# Altium project FREQUENCY_METER.PrjPcb
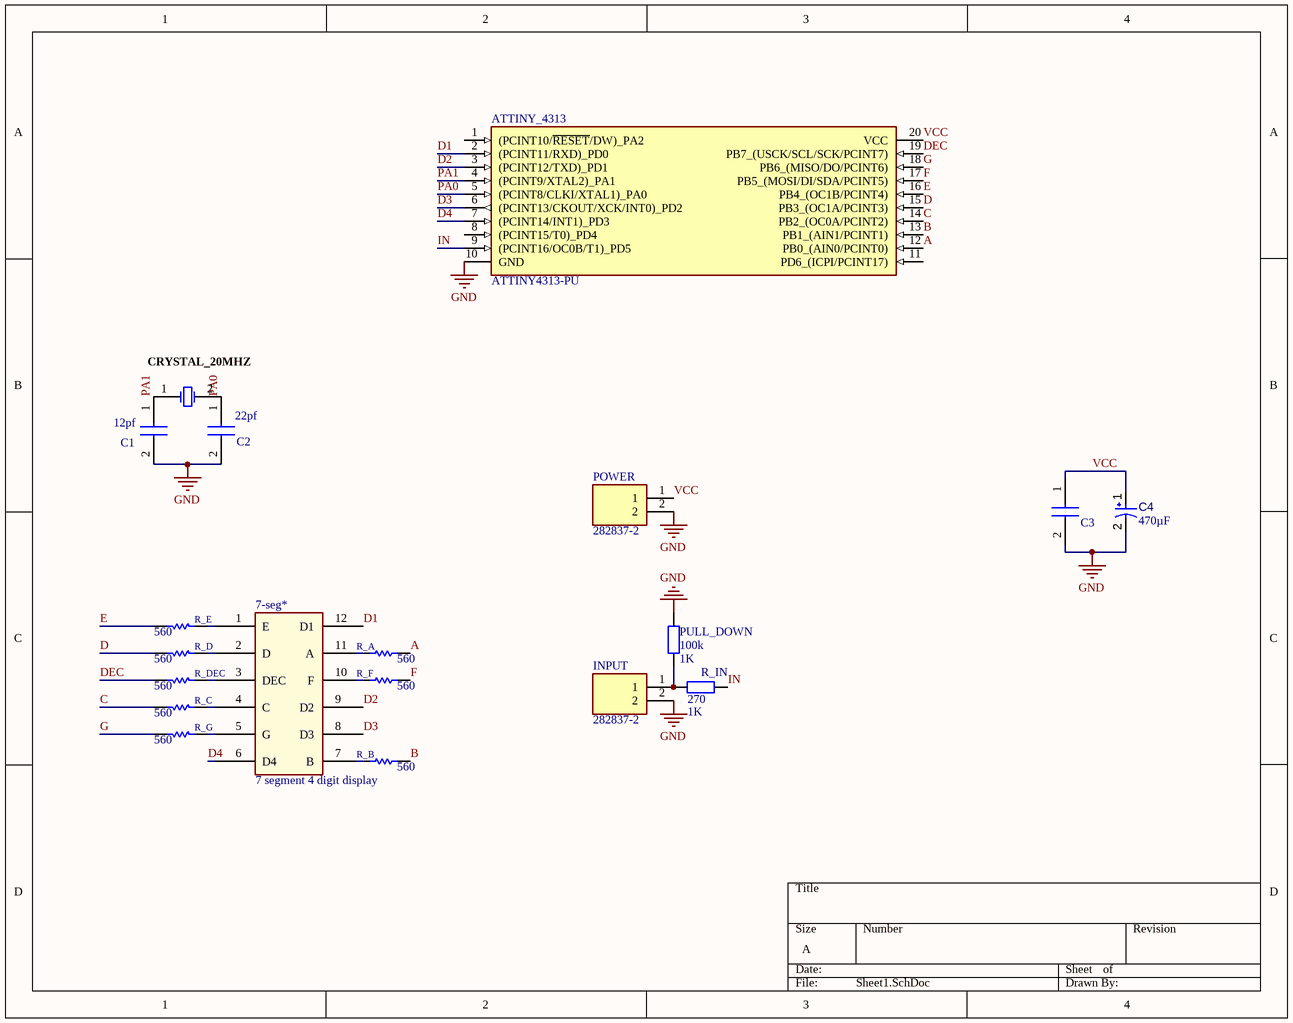
[diagram p0: Sheet1.SchDoc]
1 sheet, 19 parts. Net scope: global (net labels, ports and power ports of the same name join across sheets).
Board file: PCB1.PcbDoc

## Sheet Sheet1.SchDoc
size A; SheetNumber: 1; SheetTotal: 1

### Parts
7-seg*  7 segment 4 digit display  [PCBComponent_1]
ATTINY_4313  ATTINY4313-PU  [DIP794W56P254L2574H533Q20N]
C1  12pf  [C320C104KCR5TA]
C2  22pf  [C320C104KCR5TA]
C3  C320C104KCR5TA  [C320C104KCR5TA]  (value not drawn)
C4  value 470µF  [CAPPR65-350-1150X800X1250]  (hidden comment: ECA1HM101)
CRYSTAL_20MHZ  FOXSLF/080-20  [FOX-FOXSLF080-20]  (value not drawn)
INPUT  282837-2  [2828372]
POWER  282837-2  [2828372]
PULL_DOWN  100k  value 1K  [AXIAL-0.4]
R_A  value 560  [AXIAL-0.3]  (hidden comment: Res1)
R_B  value 560  [AXIAL-0.3]  (hidden comment: Res1)
R_C  value 560  [AXIAL-0.3]  (hidden comment: Res1)
R_D  value 560  [AXIAL-0.3]  (hidden comment: Res1)
R_DEC  value 560  [AXIAL-0.3]  (hidden comment: Res1)
R_E  value 560  [AXIAL-0.3]  (hidden comment: Res1)
R_F  value 560  [AXIAL-0.3]  (hidden comment: Res1)
R_G  value 560  [AXIAL-0.3]  (hidden comment: Res1)
R_IN  270  value 1K  [AXIAL-0.4]

### Nets
GND: ATTINY_4313.10(GND) C1.2 C2.2 C3.2 C4.2 INPUT.2 POWER.2 PULL_DOWN.2
A: ATTINY_4313.12(PB0_(AIN0/PCINT0)) R_A.2
B: ATTINY_4313.13(PB1_(AIN1/PCINT1)) R_B.2
C: ATTINY_4313.14(PB2_(OC0A/PCINT2)) R_C.2
D: ATTINY_4313.15(PB3_(OC1A/PCINT3)) R_D.2
D1: 7-seg*.12(D1) ATTINY_4313.2((PCINT11/RXD)_PD0)
D2: 7-seg*.9(D2) ATTINY_4313.3((PCINT12/TXD)_PD1)
D3: 7-seg*.8(D3) ATTINY_4313.6((PCINT13/CKOUT/XCK/INT0)_PD2)
D4: 7-seg*.6(D4) ATTINY_4313.7((PCINT14/INT1)_PD3)
DEC: ATTINY_4313.19(PB7_(USCK/SCL/SCK/PCINT7)) R_DEC.2
E: ATTINY_4313.16(PB4_(OC1B/PCINT4)) R_E.2
F: ATTINY_4313.17(PB5_(MOSI/DI/SDA/PCINT5)) R_F.2
G: ATTINY_4313.18(PB6_(MISO/DO/PCINT6)) R_G.2
IN: ATTINY_4313.9((PCINT16/OC0B/T1)_PD5) R_IN.1
PA0: ATTINY_4313.5((PCINT8/CLKI/XTAL1)_PA0) C2.1 CRYSTAL_20MHZ.2
PA1: ATTINY_4313.4((PCINT9/XTAL2)_PA1) C1.1 CRYSTAL_20MHZ.1
VCC: ATTINY_4313.20(VCC) C3.1 C4.1 POWER.1
Net7-seg*_1: 7-seg*.1(E) R_E.1
Net7-seg*_2: 7-seg*.2(D) R_D.1
Net7-seg*_3: 7-seg*.3(DEC) R_DEC.1
Net7-seg*_4: 7-seg*.4(C) R_C.1
Net7-seg*_5: 7-seg*.5(G) R_G.1
Net7-seg*_7: 7-seg*.7(B) R_B.1
Net7-seg*_10: 7-seg*.10(F) R_F.1
Net7-seg*_11: 7-seg*.11(A) R_A.1
NetINPUT_1: INPUT.1 PULL_DOWN.1 R_IN.2

Not connected (* = marked no-connect by the designer): ATTINY_4313 1((PCINT10/~{RESET}/DW)_PA2) 8((PCINT15/T0)_PD4) 11(PD6_(ICPI/PCINT17))

### Library data of the parts
ATTINY_4313 = ATTINY4313-PU: Integrated Circuit; Manufacturer_Name: Microchip; Datasheet Link: http://www.atmel.com/images/8246s.pdf; Height: 5.334mm; Manufacturer_Part_Number: ATTINY4313-PU; Mouser Part Number: 556-ATTINY4313-PU; Mouser Price/Stock: https://www.mouser.co.uk/ProductDetail/Microchip-Technology/ATTINY4313-PU?qs=lwdSMh1%2FoYKRSyWx6oCIeQ%3D%3D; Arrow Part Number: ATTINY4313-PU; Arrow Price/Stock: https://www.arrow.com/en/products/attiny4313-pu/microchip-technology?region=nac
C1-C3 = C320C104KCR5TA: Capacitor; Manufacturer_Name: KEMET; Datasheet Link: https://content.kemet.com/datasheets/KEM_C1055_HIVOLT_GOLDMAX_300_X7R.pdf; Height: 7.36mm; Manufacturer_Part_Number: C320C104KCR5TA; Mouser Part Number: 80-C320C104KCR; Mouser Price/Stock: https://www.mouser.com/Search/Refine.aspx?Keyword=80-C320C104KCR; Arrow Part Number: C320C104KCR5TA; Arrow Price/Stock: https://www.arrow.com/en/products/c320c104kcr5ta/kemet-corporation
C4 = CMP-001-00026-7: Aluminum Electrolytic Capacitor, 100 uF, +/- 20%, 50 V, -40 to 85 degC, 2-Pin THD, RoHS, Bulk; Manufacturer: Panasonic; Voltage Rating: 50V; Ripple Current: 250mA; Datasheet URL: https://industrial.panasonic.com/cdbs/www-data/pdf/RDF0000/ABA0000C1218.pdf; Lead Pitch: 3.5mm; Mounting Technology: TH; Package Description: 2-Pin Radial Lead, Dia 8 mm, Height 12.5 mm; Diameter: 8mm; Ripple Current (AC): 250mA; Manufacturer URL: http://www.panasonic.com/; Capacitor Type: Electrolytic; Max Operating Temperature: 85°C; Pins: 2; Min Operating Temperature: -40°C; Tolerance: 20%; Case/Package: Radial; Packaging: Bulk; Package Quantity: 200; Package Reference: CAPPR65-350-1150X800X1250; RoHS Compliant: True; Datasheet Version: Rev. 05, 10/2016
CRYSTAL_20MHZ = CMP-003-00025-2: Resistance Weld Thru-Hole Crystal, 8 MHz, +/- 50 ppm, 10 pF, -20 to 70 degC, 2-Pin THD, RoHS, Bulk; Manufacturer: FOX Electronics; Load Capacitance: 20pF; Frequency Tolerance: 30ppm; Tolerance: 50ppm; ESR: 80; Resistance: 80Ohm; Frequency: 8MHz; Packaging: Bulk; Datasheet Version: Mar-15; Manufacturer URL: http://www.foxonline.com/; Package Reference: FOXSLF080-20; Max Operating Temperature: 70°C; Package Quantity: 100; RoHS Compliant: True; Pins: 2; Mounting Technology: TH; Package Description: 2-Pin Through Hole Device, Body 11.35 x 4.65 mm; Datasheet URL: http://download.siliconexpert.com/pdfs/2015/4/5/6/5/7/200/fox_/manual/35607121449963728hc49slf.pdf; Min Operating Temperature: -20°C; Case/Package: FOXSLF080-20
INPUT POWER = 282837-2: Connector; Manufacturer_Name: TE Connectivity; Datasheet Link: https://www.te.com/commerce/DocumentDelivery/DDEController?Action=srchrtrv&DocNm=282837&DocType=Customer+Drawing&DocLang=English&DocFormat=pdf&PartCntxt=282837-2; Height: 10.3mm; Manufacturer_Part_Number: 282837-2; Mouser Part Number: 571-2828372; Mouser Price/Stock: https://www.mouser.co.uk/ProductDetail/TE-Connectivity/282837-2?qs=A%252Bip%252BNCYi6O2H0NGWOeAxg%3D%3D; Arrow Part Number: 282837-2; Arrow Price/Stock: https://www.arrow.com/en/products/282837-2/te-connectivity?region=europe
PULL_DOWN R_IN = Res2: Resistor; Published: 8-Jun-2000; LatestRevisionDate: 17-Jul-2002; LatestRevisionNote: Re-released for DXP Platform.; PackageReference: AXIAL-0.4; Publisher: Altium Limited; PackageDescription: Axial Device, Thru-Hole; 2 Leads; 0.4 in Pin Spacing
R_A R_B R_C R_D R_DEC R_E R_F R_G = Res1: Resistor; Published: 8-Jun-2000; LatestRevisionDate: 17-Jul-2002; LatestRevisionNote: Re-released for DXP Platform.; PackageReference: AXIAL-0.3; Publisher: Altium Limited; PackageDescription: Axial Device, Thru-Hole; 2 Leads; 0.3 in Pin Spacing